# Altium schematic sheet STM32.SchDoc
size A3; Organization: RIT/SPEX; Address1: Rochester Institute of Technology; Address2: Rochester; Address3: New York; Address4: USA
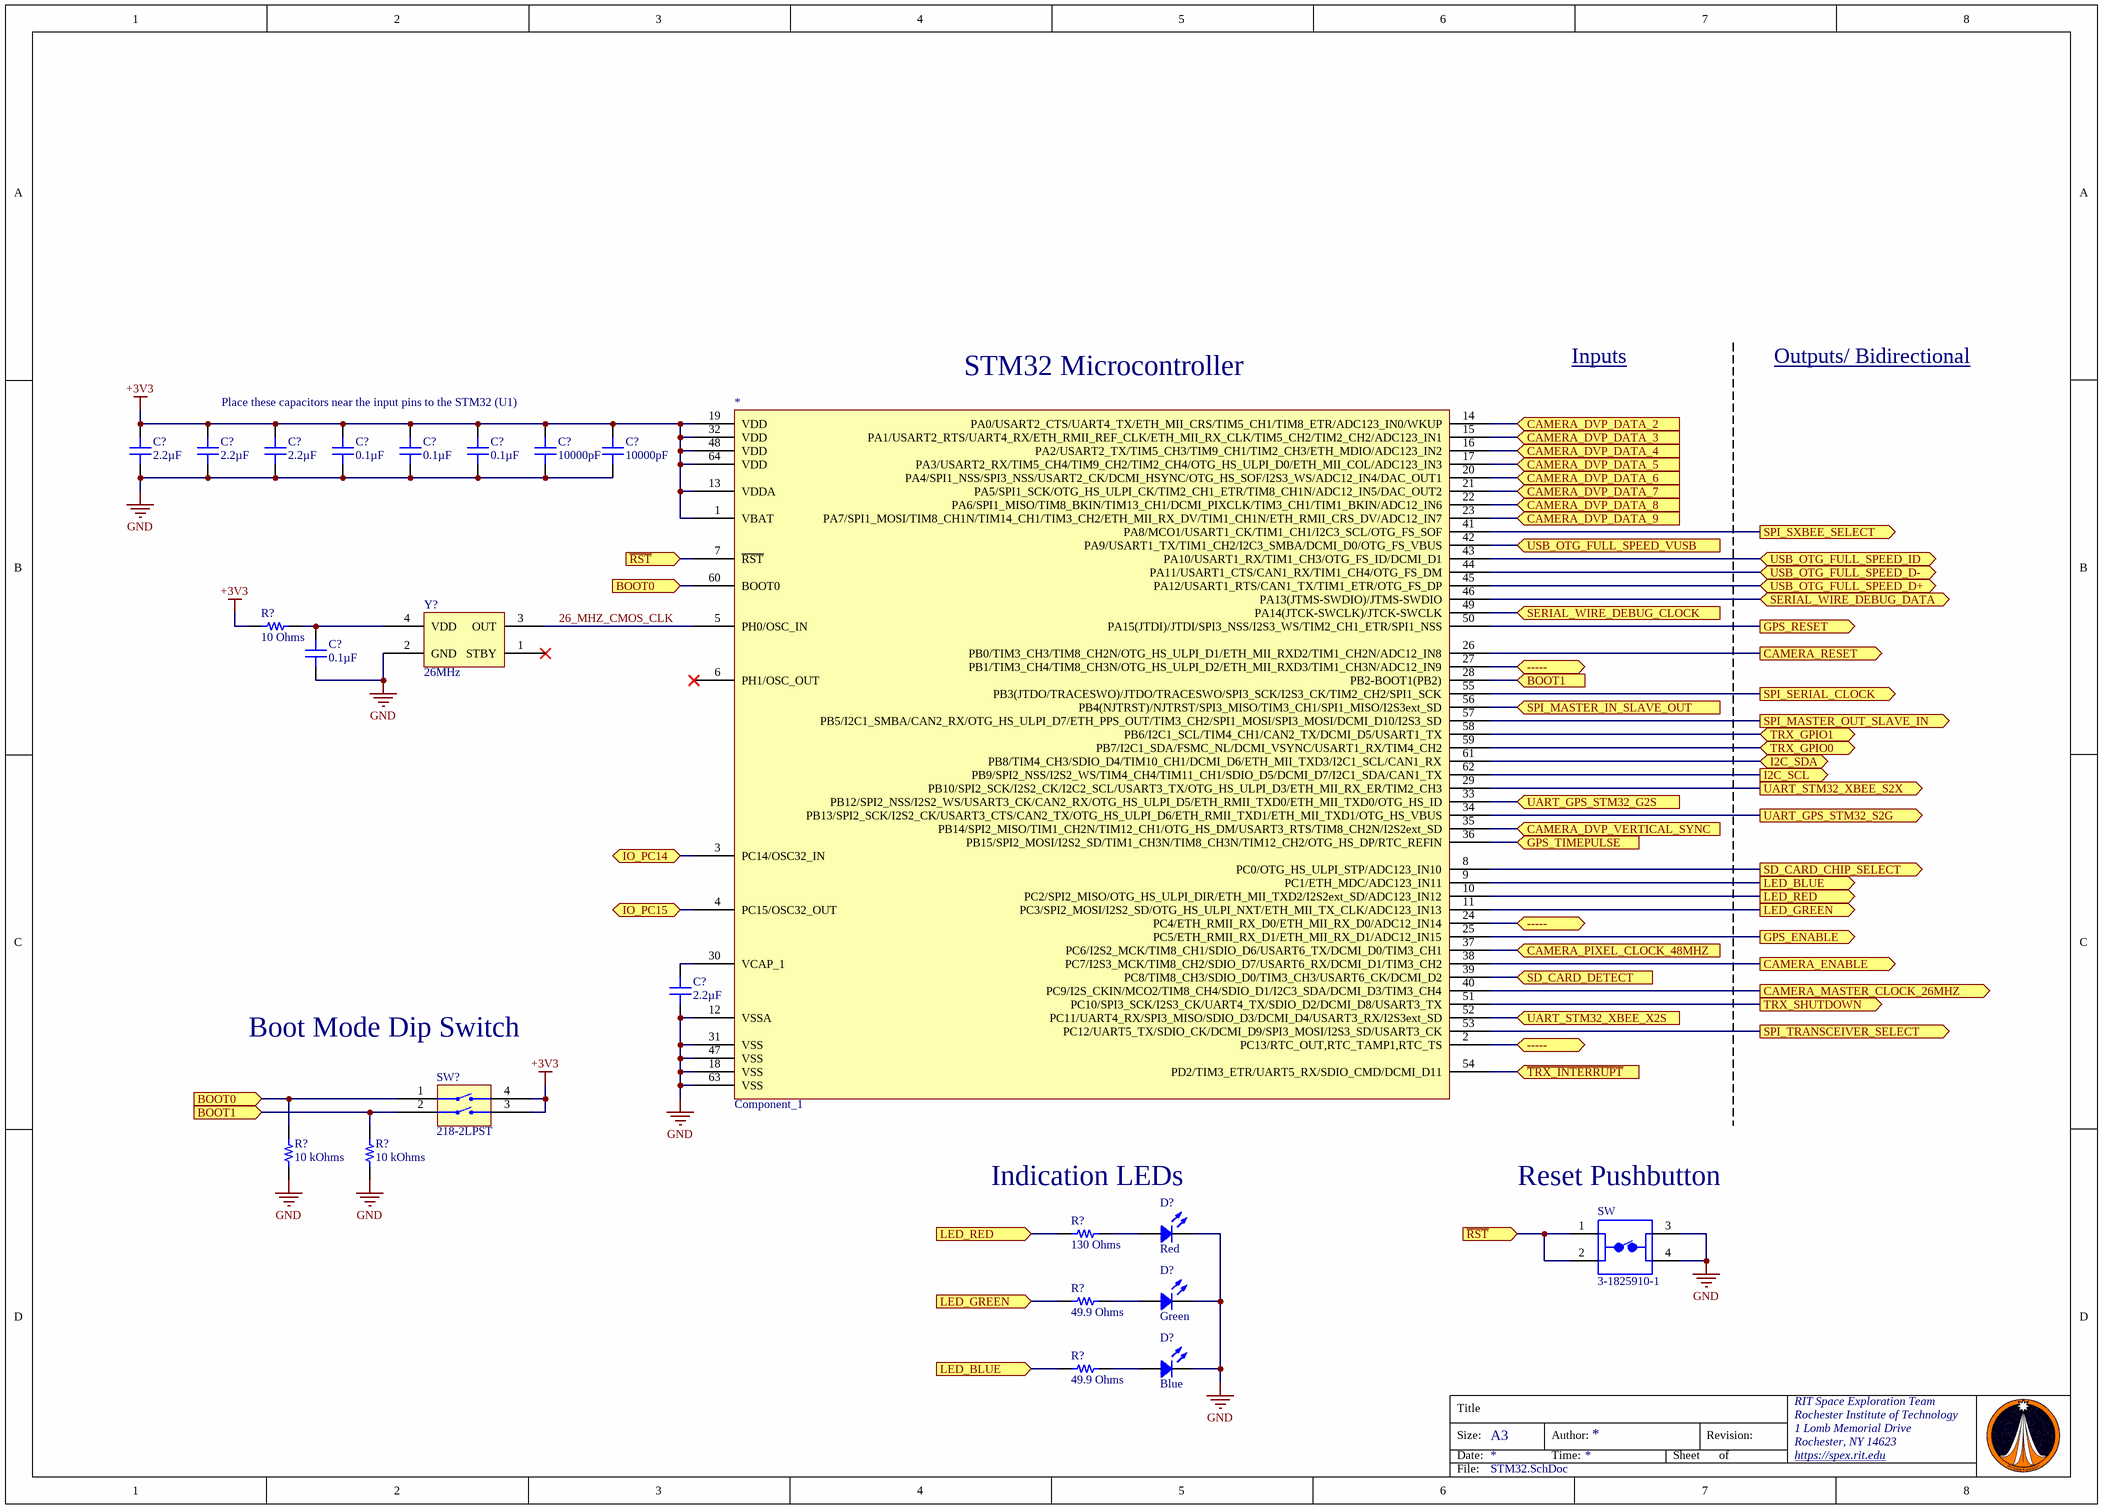
[diagram p0: STM32.SchDoc]

## Parts
(Parts that share a designator on the sheet are numbered #1, #2 ... from top to bottom, then left to right.)
*  Component_1
C?#1  2.2µF  [CAP 0603_1608]
C?#2  2.2µF  [CAP 0603_1608]
C?#3  2.2µF  [CAP 0603_1608]
C?#4  0.1µF  [CAP 0603_1608]
C?#5  0.1µF  [CAP 0603_1608]
C?#6  0.1µF  [CAP 0603_1608]
C?#7  10000pF  [CAP 0603_1608]
C?#8  10000pF  [CAP 0603_1608]
C?#9  0.1µF  [CAP 0603_1608]
C?#10  2.2µF  [CAP 0603_1608]
D?#1  Red  [LED 0603_1608 RED]
D?#2  Green  [LED 0603_1608 GREEN]
D?#3  Blue  [LED 0603_1608 BLUE]
R?#1  10 Ohms  [RES 0603_1608]
R?#2  10 kOhms  [RES 0603_1608]
R?#3  10 kOhms  [RES 0603_1608]
R?#4  130 Ohms  [RES 0603_1608]
R?#5  49.9 Ohms  [RES 0603_1608]
R?#6  49.9 Ohms  [RES 0603_1608]
SW  3-1825910-1  [TE_3-1825910-1]
SW?  218-2LPST  [CTS 218-2LPJ]
Y?  26MHz  [ABRACON ASDMB]

## Ports
----- (bidir), BOOT0 (in), BOOT1 (in), CAMERA_DVP_DATA_2 (in), CAMERA_DVP_DATA_3 (in), CAMERA_DVP_DATA_4 (in), CAMERA_DVP_DATA_5 (in), CAMERA_DVP_DATA_6 (in), CAMERA_DVP_DATA_7 (in), CAMERA_DVP_DATA_8 (in), CAMERA_DVP_DATA_9 (in), CAMERA_DVP_VERTICAL_SYNC (in), CAMERA_ENABLE (out), CAMERA_MASTER_CLOCK_26MHZ (out), CAMERA_PIXEL_CLOCK_48MHZ (in), CAMERA_RESET (out), GPS_ENABLE (out), GPS_RESET (out), GPS_TIMEPULSE (in), I2C_SCL (out), I2C_SDA (bidir), IO_PC14 (bidir), IO_PC15 (bidir), LED_BLUE (in), LED_BLUE (out), LED_GREEN (in), LED_GREEN (out), LED_RED (in), LED_RED (out), SD_CARD_CHIP_SELECT (out), SD_CARD_DETECT (in), SERIAL_WIRE_DEBUG_CLOCK (in), SERIAL_WIRE_DEBUG_DATA (bidir), SPI_MASTER_IN_SLAVE_OUT (in), SPI_MASTER_OUT_SLAVE_IN (out), SPI_SERIAL_CLOCK (out), SPI_SXBEE_SELECT (out), SPI_TRANSCEIVER_SELECT (out), TRX_GPIO0 (bidir), TRX_GPIO1 (bidir), TRX_SHUTDOWN (out), UART_GPS_STM32_G2S (in), UART_GPS_STM32_S2G (out), UART_STM32_XBEE_S2X (out), UART_STM32_XBEE_X2S (in), USB_OTG_FULL_SPEED_D+ (bidir), USB_OTG_FULL_SPEED_D- (bidir), USB_OTG_FULL_SPEED_ID (bidir), USB_OTG_FULL_SPEED_VUSB (in), ~{RST} (in), ~{TRX_INTERRUPT} (in)

## Nets
+3V3: *.1(VBAT) *.13(VDDA) *.19(VDD) *.32(VDD) *.48(VDD) *.64(VDD) C?#1.1 C?#2.1 C?#3.1 C?#4.1 C?#5.1 C?#6.1 C?#7.2 C?#8.2 R?#1.2 SW?.3(GND) SW?.4(GND)
GND: *.12(VSSA) *.18(VSS) *.31(VSS) *.47(VSS) *.63(VSS) C?#1.2 C?#2.2 C?#3.2 C?#4.2 C?#5.2 C?#6.2 C?#7.1 C?#8.1 C?#9.2 C?#10.2 D?#1.2 D?#2.2 D?#3.2 R?#2.1 R?#3.1 SW.3 SW.4 Y?.2(GND)
26_MHZ_CMOS_CLK: *.5(PH0/OSC_IN) Y?.3(OUT)
-----: *.2(PC13/RTC_OUT,RTC_TAMP1,RTC_TS) *.24(PC4/ETH_RMII_RX_D0/ETH_MII_RX_D0/ADC12_IN14) *.27(PB1/TIM3_CH4/TIM8_CH3N/OTG_HS_ULPI_D2/ETH_MII_RXD3/TIM1_CH3N/ADC12_IN9) ; port -----
BOOT0: *.60(BOOT0) R?#2.2 SW?.1(GND) ; port BOOT0
BOOT1: *.28(PB2-BOOT1(PB2)) R?#3.2 SW?.2(GND) ; port BOOT1
CAMERA_DVP_DATA_2: *.14(PA0/USART2_CTS/UART4_TX/ETH_MII_CRS/TIM5_CH1/TIM8_ETR/ADC123_IN0/WKUP) ; port CAMERA_DVP_DATA_2
CAMERA_DVP_DATA_3: *.15(PA1/USART2_RTS/UART4_RX/ETH_RMII_REF_CLK/ETH_MII_RX_CLK/TIM5_CH2/TIM2_CH2/ADC123_IN1) ; port CAMERA_DVP_DATA_3
CAMERA_DVP_DATA_4: *.16(PA2/USART2_TX/TIM5_CH3/TIM9_CH1/TIM2_CH3/ETH_MDIO/ADC123_IN2) ; port CAMERA_DVP_DATA_4
CAMERA_DVP_DATA_5: *.17(PA3/USART2_RX/TIM5_CH4/TIM9_CH2/TIM2_CH4/OTG_HS_ULPI_D0/ETH_MII_COL/ADC123_IN3) ; port CAMERA_DVP_DATA_5
CAMERA_DVP_DATA_6: *.20(PA4/SPI1_NSS/SPI3_NSS/USART2_CK/DCMI_HSYNC/OTG_HS_SOF/I2S3_WS/ADC12_IN4/DAC_OUT1) ; port CAMERA_DVP_DATA_6
CAMERA_DVP_DATA_7: *.21(PA5/SPI1_SCK/OTG_HS_ULPI_CK/TIM2_CH1_ETR/TIM8_CH1N/ADC12_IN5/DAC_OUT2) ; port CAMERA_DVP_DATA_7
CAMERA_DVP_DATA_8: *.22(PA6/SPI1_MISO/TIM8_BKIN/TIM13_CH1/DCMI_PIXCLK/TIM3_CH1/TIM1_BKIN/ADC12_IN6) ; port CAMERA_DVP_DATA_8
CAMERA_DVP_DATA_9: *.23(PA7/SPI1_MOSI/TIM8_CH1N/TIM14_CH1/TIM3_CH2/ETH_MII_RX_DV/TIM1_CH1N/ETH_RMII_CRS_DV/ADC12_IN7) ; port CAMERA_DVP_DATA_9
CAMERA_DVP_VERTICAL_SYNC: *.35(PB14/SPI2_MISO/TIM1_CH2N/TIM12_CH1/OTG_HS_DM/USART3_RTS/TIM8_CH2N/I2S2ext_SD) ; port CAMERA_DVP_VERTICAL_SYNC
CAMERA_ENABLE: *.38(PC7/I2S3_MCK/TIM8_CH2/SDIO_D7/USART6_RX/DCMI_D1/TIM3_CH2) ; port CAMERA_ENABLE
CAMERA_MASTER_CLOCK_26MHZ: *.40(PC9/I2S_CKIN/MCO2/TIM8_CH4/SDIO_D1/I2C3_SDA/DCMI_D3/TIM3_CH4) ; port CAMERA_MASTER_CLOCK_26MHZ
CAMERA_PIXEL_CLOCK_48MHZ: *.37(PC6/I2S2_MCK/TIM8_CH1/SDIO_D6/USART6_TX/DCMI_D0/TIM3_CH1) ; port CAMERA_PIXEL_CLOCK_48MHZ
CAMERA_RESET: *.26(PB0/TIM3_CH3/TIM8_CH2N/OTG_HS_ULPI_D1/ETH_MII_RXD2/TIM1_CH2N/ADC12_IN8) ; port CAMERA_RESET
GPS_ENABLE: *.25(PC5/ETH_RMII_RX_D1/ETH_MII_RX_D1/ADC12_IN15) ; port GPS_ENABLE
GPS_RESET: *.50(PA15(JTDI)/JTDI/SPI3_NSS/I2S3_WS/TIM2_CH1_ETR/SPI1_NSS) ; port GPS_RESET
GPS_TIMEPULSE: *.36(PB15/SPI2_MOSI/I2S2_SD/TIM1_CH3N/TIM8_CH3N/TIM12_CH2/OTG_HS_DP/RTC_REFIN) ; port GPS_TIMEPULSE
I2C_SCL: *.62(PB9/SPI2_NSS/I2S2_WS/TIM4_CH4/TIM11_CH1/SDIO_D5/DCMI_D7/I2C1_SDA/CAN1_TX) ; port I2C_SCL
I2C_SDA: *.61(PB8/TIM4_CH3/SDIO_D4/TIM10_CH1/DCMI_D6/ETH_MII_TXD3/I2C1_SCL/CAN1_RX) ; port I2C_SDA
IO_PC14: *.3(PC14/OSC32_IN) ; port IO_PC14
IO_PC15: *.4(PC15/OSC32_OUT) ; port IO_PC15
LED_BLUE: *.9(PC1/ETH_MDC/ADC123_IN11) R?#6.1 ; port LED_BLUE
LED_GREEN: *.11(PC3/SPI2_MOSI/I2S2_SD/OTG_HS_ULPI_NXT/ETH_MII_TX_CLK/ADC123_IN13) R?#5.1 ; port LED_GREEN
LED_RED: *.10(PC2/SPI2_MISO/OTG_HS_ULPI_DIR/ETH_MII_TXD2/I2S2ext_SD/ADC123_IN12) R?#4.1 ; port LED_RED
~{RST}: *.7(~{RST}) SW.1 SW.2 ; port ~{RST}
SD_CARD_CHIP_SELECT: *.8(PC0/OTG_HS_ULPI_STP/ADC123_IN10) ; port SD_CARD_CHIP_SELECT
SD_CARD_DETECT: *.39(PC8/TIM8_CH3/SDIO_D0/TIM3_CH3/USART6_CK/DCMI_D2) ; port SD_CARD_DETECT
SERIAL_WIRE_DEBUG_CLOCK: *.49(PA14(JTCK-SWCLK)/JTCK-SWCLK) ; port SERIAL_WIRE_DEBUG_CLOCK
SERIAL_WIRE_DEBUG_DATA: *.46(PA13(JTMS-SWDIO)/JTMS-SWDIO) ; port SERIAL_WIRE_DEBUG_DATA
SPI_MASTER_IN_SLAVE_OUT: *.56(PB4(NJTRST)/NJTRST/SPI3_MISO/TIM3_CH1/SPI1_MISO/I2S3ext_SD) ; port SPI_MASTER_IN_SLAVE_OUT
SPI_MASTER_OUT_SLAVE_IN: *.57(PB5/I2C1_SMBA/CAN2_RX/OTG_HS_ULPI_D7/ETH_PPS_OUT/TIM3_CH2/SPI1_MOSI/SPI3_MOSI/DCMI_D10/I2S3_SD) ; port SPI_MASTER_OUT_SLAVE_IN
SPI_SERIAL_CLOCK: *.55(PB3(JTDO/TRACESWO)/JTDO/TRACESWO/SPI3_SCK/I2S3_CK/TIM2_CH2/SPI1_SCK) ; port SPI_SERIAL_CLOCK
SPI_SXBEE_SELECT: *.41(PA8/MCO1/USART1_CK/TIM1_CH1/I2C3_SCL/OTG_FS_SOF) ; port SPI_SXBEE_SELECT
SPI_TRANSCEIVER_SELECT: *.53(PC12/UART5_TX/SDIO_CK/DCMI_D9/SPI3_MOSI/I2S3_SD/USART3_CK) ; port SPI_TRANSCEIVER_SELECT
~{TRX_INTERRUPT}: *.54(PD2/TIM3_ETR/UART5_RX/SDIO_CMD/DCMI_D11) ; port ~{TRX_INTERRUPT}
TRX_GPIO0: *.59(PB7/I2C1_SDA/FSMC_NL/DCMI_VSYNC/USART1_RX/TIM4_CH2) ; port TRX_GPIO0
TRX_GPIO1: *.58(PB6/I2C1_SCL/TIM4_CH1/CAN2_TX/DCMI_D5/USART1_TX) ; port TRX_GPIO1
TRX_SHUTDOWN: *.51(PC10/SPI3_SCK/I2S3_CK/UART4_TX/SDIO_D2/DCMI_D8/USART3_TX) ; port TRX_SHUTDOWN
UART_GPS_STM32_G2S: *.33(PB12/SPI2_NSS/I2S2_WS/USART3_CK/CAN2_RX/OTG_HS_ULPI_D5/ETH_RMII_TXD0/ETH_MII_TXD0/OTG_HS_ID) ; port UART_GPS_STM32_G2S
UART_GPS_STM32_S2G: *.34(PB13/SPI2_SCK/I2S2_CK/USART3_CTS/CAN2_TX/OTG_HS_ULPI_D6/ETH_RMII_TXD1/ETH_MII_TXD1/OTG_HS_VBUS) ; port UART_GPS_STM32_S2G
UART_STM32_XBEE_S2X: *.29(PB10/SPI2_SCK/I2S2_CK/I2C2_SCL/USART3_TX/OTG_HS_ULPI_D3/ETH_MII_RX_ER/TIM2_CH3) ; port UART_STM32_XBEE_S2X
UART_STM32_XBEE_X2S: *.52(PC11/UART4_RX/SPI3_MISO/SDIO_D3/DCMI_D4/USART3_RX/I2S3ext_SD) ; port UART_STM32_XBEE_X2S
USB_OTG_FULL_SPEED_D+: *.45(PA12/USART1_RTS/CAN1_TX/TIM1_ETR/OTG_FS_DP) ; port USB_OTG_FULL_SPEED_D+
USB_OTG_FULL_SPEED_D-: *.44(PA11/USART1_CTS/CAN1_RX/TIM1_CH4/OTG_FS_DM) ; port USB_OTG_FULL_SPEED_D-
USB_OTG_FULL_SPEED_ID: *.43(PA10/USART1_RX/TIM1_CH3/OTG_FS_ID/DCMI_D1) ; port USB_OTG_FULL_SPEED_ID
USB_OTG_FULL_SPEED_VUSB: *.42(PA9/USART1_TX/TIM1_CH2/I2C3_SMBA/DCMI_D0/OTG_FS_VBUS) ; port USB_OTG_FULL_SPEED_VUSB
Net*_30: *.30(VCAP_1) C?#10.1
NetC?#9_1: C?#9.1 R?#1.1 Y?.4(VDD)
NetD?#1_1: D?#1.1 R?#4.2
NetD?#2_1: D?#2.1 R?#5.2
NetD?#3_1: D?#3.1 R?#6.2

Not connected (* = marked no-connect by the designer): * 6(PH1/OSC_OUT)*; Y? 1(STBY)*

## Notes on the sheet
- (near *) STM32 Microcontroller
- Inputs
- Outputs/ Bidirectional
- (near C?#4) Place these capacitors near the input pins to the STM32 (U1)
- Boot Mode Dip Switch
- Indication LEDs
- (near SW) Reset Pushbutton
- Title
- Size:
- Date:
- A3
- Author:
- Time:
- Sheet
- Revision:
- of
- RIT Space Exploration Team
- Rochester Institute of Technology
- 1 Lomb Memorial Drive
- Rochester, NY 14623
- https://spex.rit.edu
- File:

## Library data of the parts
C?#1-C?#3 C?#10 = GRM188R71A225KE15D: CAP CER 2.2UF 10V X7R 0603; Manufacturer: Murata Electronics; Tolerance: ±10%; Part Number: GRM188R71A225KE15D; Value: 2.2µF; Applications: General Purpose; Capacitance: 2.2µF; ComponentLink1Description: Datasheet; ComponentLink1URL: https://www.murata.com/~/media/webrenewal/support/library/catalog/products/capacitor/mlcc/c02e.ashx?la=en-us; ComponentLink2Description: DigiKey Link; ComponentLink2URL: http://digikey.com/product-detail/en/murata-electronics/GRM188R71A225KE15D/490-4520-1-ND/1033279; Device Package: 0603 (1608 Metric); LastUpdated: 1/21/2020 12:02:07 AM; Lifecycle Status: Active; Minimum Order: 1; Mounting Type: Surface Mount, MLCC; Operating Temperature: -55°C ~ 125°C; Package / Case: 0603 (1608 Metric); Packaging: TapeAndReel; PartId: 3946; Part Status: Active; Price: 0.05; Series: GRM; Size / Dimension: 0.063" L x 0.031" W (1.60mm x 0.80mm); Supplier 1: DigiKey; Supplier Part Number 1: 490-4520-1-ND; Temperature Coefficient: X7R; Thickness (Max): 0.035" (0.90mm); Voltage - Rated: 10V
C?#4-C?#6 C?#9 = 100X14W104MV4T: CAP CER 0.1UF 10V X7R 0603; Manufacturer: Johanson Dielectrics Inc.; Tolerance: ±20%; Part Number: 100X14W104MV4T; Value: 0.1µF; Applications: Bypass, Decoupling; Capacitance: 0.1µF; ComponentLink1Description: Datasheet; ComponentLink1URL: https://www.johansondielectrics.com/downloads/x2y-filter-and-decoupling-capacitors.pdf; ComponentLink2Description: DigiKey Link; ComponentLink2URL: http://digikey.com/product-detail/en/johanson-dielectrics-inc/100X14W104MV4T/709-1101-1-ND/1655915; Device Package: 0603 (1608 Metric); Features: Low ESL (X2Y); LastUpdated: 1/21/2020 12:02:09 AM; Lifecycle Status: Active; Minimum Order: 1; Mounting Type: Surface Mount, MLCC; Operating Temperature: -55°C ~ 125°C; Package / Case: 0603 (1608 Metric); Packaging: TapeAndReel; PartId: 2680; Part Status: Active; Price: 0.11; Series: X2Y®; Size / Dimension: 0.064" L x 0.035" W (1.63mm x 0.89mm); Supplier 1: DigiKey; Supplier Part Number 1: 709-1101-1-ND; Temperature Coefficient: X7R; Thickness (Max): 0.026" (0.66mm); Voltage - Rated: 10V
C?#7 C?#8 = C0603S103K4RACTU: CAP CER 10000PF 16V X7R 0603; Manufacturer: KEMET; Tolerance: ±10%; Part Number: C0603S103K4RACTU; Value: 10000pF; Applications: Boardflex Sensitive; Capacitance: 10000pF; ComponentLink1Description: Datasheet; ComponentLink1URL: https://api.kemet.com/component-edge/download/datasheet/C0603S103K4RACTU.pdf; ComponentLink2Description: DigiKey Link; ComponentLink2URL: http://digikey.com/product-detail/en/kemet/C0603S103K4RACTU/399-9135-1-ND/3522653; Device Package: 0603 (1608 Metric); Features: Floating Electrode; LastUpdated: 1/21/2020 12:02:08 AM; Lifecycle Status: Active; Minimum Order: 1; Mounting Type: Surface Mount, MLCC; Operating Temperature: -55°C ~ 125°C; Package / Case: 0603 (1608 Metric); Packaging: TapeAndReel; PartId: 3312; Part Status: Active; Price: 0.07; Series: SMD Comm X7R FE; Size / Dimension: 0.063" L x 0.031" W (1.60mm x 0.80mm); Supplier 1: DigiKey; Supplier Part Number 1: 399-9135-1-ND; Temperature Coefficient: X7R; Thickness (Max): 0.034" (0.87mm); Voltage - Rated: 16V
D?#1 = LS Q976-NR-1: LED RED DIFFUSED 0603 SMD; Manufacturer: OSRAM Opto Semiconductors Inc.; Configuration: Standard; Current - Test: 20mA; Lens Color: White; Lens Size: 1.00mm x 0.80mm; Lens Style: Rectangle with Flat Top; Millicandela Rating: 104mcd; Viewing Angle: 160°; Voltage - Forward (Vf) (Typ): 2V; Wavelength - Dominant: 633nm; Wavelength - Peak: 645nm; Part Number: LS Q976-NR-1; Color: Red; ComponentLink1Description: Datasheet; ComponentLink1URL: https://dammedia.osram.info/media/resource/hires/osram-dam-2493499/LS%20Q976.pdf; ComponentLink2Description: DigiKey Link; ComponentLink2URL: http://digikey.com/product-detail/en/osram-opto-semiconductors-inc/LS-Q976-NR-1/475-2512-1-ND/1802639; Device Package: 0603 (1608 Metric); Height (Max): 0.80mm; LastUpdated: 1/21/2020 3:13:21 AM; Lens Transparency: Diffused; Lifecycle Status: Active; Minimum Order: 1; Mounting Type: Surface Mount; Package / Case: 0603 (1608 Metric); Packaging: TapeAndReel; PartId: 457; Part Status: Active; Price: 0.05; Series: CHIPLED 0603; Size / Dimension: 1.60mm L x 0.80mm W; Supplier 1: DigiKey; Supplier Part Number 1: 475-2512-1-ND; Supplier Device Package: 0603; Value: Red
D?#2 = LT Q39G-Q1OO-25-1: LED GREEN DIFFUSED 0603 SMD; Manufacturer: OSRAM Opto Semiconductors Inc.; Configuration: Standard; Current - Test: 5mA; Lens Color: White; Lens Size: 1.10mm x 0.80mm; Lens Style: Rectangle with Flat Top; Millicandela Rating: 175.5mcd; Viewing Angle: 170°, 130°; Voltage - Forward (Vf) (Typ): 2.85V; Wavelength - Dominant: 530nm; Wavelength - Peak: 525nm; Part Number: LT Q39G-Q1OO-25-1; Color: Green; ComponentLink1Description: Datasheet; ComponentLink1URL: https://dammedia.osram.info/media/resource/hires/osram-dam-2493418/LT%20Q39G.pdf; ComponentLink2Description: DigiKey Link; ComponentLink2URL: http://digikey.com/product-detail/en/osram-opto-semiconductors-inc/LT-Q39G-Q1OO-25-1/475-3442-1-ND/7908059; Device Package: 0603 (1608 Metric); Height (Max): 0.40mm; LastUpdated: 1/21/2020 3:12:08 AM; Lens Transparency: Diffused; Lifecycle Status: Active; Minimum Order: 1; Mounting Type: Surface Mount; Package / Case: 0603 (1608 Metric); Packaging: TapeAndReel; PartId: 689; Part Status: Active; Price: 0.08; Series: CHIPLED 0603; Size / Dimension: 1.60mm L x 0.80mm W; Supplier 1: DigiKey; Supplier Part Number 1: 475-3442-1-ND; Supplier Device Package: 0603; Value: Green
D?#3 = LB Q39E-N1OO-35-1: LED BLUE DIFFUSED 0603 SMD; Manufacturer: OSRAM Opto Semiconductors Inc.; Configuration: Standard; Current - Test: 5mA; Lens Color: White; Lens Size: 1.10mm x 0.80mm; Lens Style: Rectangle with Flat Top; Millicandela Rating: 42mcd; Viewing Angle: 170°, 130°; Voltage - Forward (Vf) (Typ): 2.85V; Wavelength - Dominant: 470nm; Wavelength - Peak: 465nm; Part Number: LB Q39E-N1OO-35-1; Color: Blue; ComponentLink1Description: Datasheet; ComponentLink1URL: https://dammedia.osram.info/media/resource/hires/osram-dam-2494408/LB%20Q39E.pdf; ComponentLink2Description: DigiKey Link; ComponentLink2URL: http://digikey.com/product-detail/en/osram-opto-semiconductors-inc/LB-Q39E-N1OO-35-1/475-2815-1-ND/2176354; Device Package: 0603 (1608 Metric); Height (Max): 0.40mm; LastUpdated: 1/21/2020 3:10:55 AM; Lens Transparency: Diffused; Lifecycle Status: Active; Minimum Order: 1; Mounting Type: Surface Mount; Package / Case: 0603 (1608 Metric); Packaging: TapeAndReel; PartId: 840; Part Status: Active; Price: 0.10; Series: CHIPLED 0603; Size / Dimension: 1.60mm L x 0.80mm W; Supplier 1: DigiKey; Supplier Part Number 1: 475-2815-1-ND; Supplier Device Package: 0603; Value: Blue
R?#1 = SG731JTTD100K: SMD RESISTOR; Manufacturer: KOA Speer Electronics, Inc.; Power (Watts): 0.1W, 1/10W; Temperature Coefficient: ±200ppm/°C; Tolerance: ±10%; Part Number: SG731JTTD100K; Value: 10 Ohms; ComponentLink1Description: Datasheet; ComponentLink1URL: http://www.koaspeer.com/catimages/Products/SG73/SG73.pdf; ComponentLink2Description: DigiKey Link; ComponentLink2URL: http://digikey.com/product-detail/en/koa-speer-electronics-inc/SG731JTTD100K/2019-SG731JTTD100KCT-ND/10187255; Composition: Thick Film; Device Package: 0603 (1608 Metric); Features: Automotive AEC-Q200, Moisture Resistant, Pulse Withstanding; Height - Seated (Max): 0.022" (0.55mm); LastUpdated: 1/21/2020 12:19:43 AM; Lifecycle Status: Active; Minimum Order: 1; Number of Terminations: 2; Operating Temperature: -55°C ~ 155°C; Package / Case: 0603 (1608 Metric); Packaging: TapeAndReel; PartId: 17783; Part Status: Active; Price: 0.02; Ratings: AEC-Q200; Resistance: 10 Ohms; Series: SG73; Size / Dimension: 0.063" L x 0.031" W (1.60mm x 0.80mm); Supplier 1: DigiKey; Supplier Part Number 1: 2019-SG731JTTD100KCT-ND; Supplier Device Package: 0603
R?#2 R?#3 = RT0603DRD0710KL: RES SMD 10K OHM 0.5% 1/10W 0603; Manufacturer: Yageo; Power (Watts): 0.1W, 1/10W; Temperature Coefficient: ±25ppm/°C; Part Number: RT0603DRD0710KL; Value: 10 kOhms; ComponentLink1Description: Datasheet; ComponentLink1URL: https://www.yageo.com/upload/media/product/productsearch/datasheet/rchip/PYu-RT_1-to-0.01_RoHS_L_11.pdf; ComponentLink2Description: DigiKey Link; ComponentLink2URL: http://digikey.com/product-detail/en/yageo/RT0603DRD0710KL/311-10KDCT-ND/1035680; Composition: Thin Film; Device Package: 0603 (1608 Metric); Height - Seated (Max): 0.022" (0.55mm); LastUpdated: 1/21/2020 12:24:44 AM; Lifecycle Status: Active; Minimum Order: 1; Number of Terminations: 2; Operating Temperature: -55°C ~ 155°C; Package / Case: 0603 (1608 Metric); Packaging: TapeAndReel; PartId: 5487; Part Status: Active; Price: 0.02; Resistance: 10 kOhms; Series: RT; Size / Dimension: 0.063" L x 0.031" W (1.60mm x 0.80mm); Supplier 1: DigiKey; Supplier Part Number 1: 311-10KDCT-ND; Supplier Device Package: 0603; Tolerance: ±0.5%
R?#4 = RT0603BRD07130RL: RES SMD 130 OHM 0.1% 1/10W 0603; Manufacturer: Yageo; Power (Watts): 0.1W, 1/10W; Temperature Coefficient: ±25ppm/°C; Part Number: RT0603BRD07130RL; Value: 130 Ohms; ComponentLink1Description: Datasheet; ComponentLink1URL: https://www.yageo.com/upload/media/product/productsearch/datasheet/rchip/PYu-RT_1-to-0.01_RoHS_L_11.pdf; ComponentLink2Description: DigiKey Link; ComponentLink2URL: http://digikey.com/product-detail/en/yageo/RT0603BRD07130RL/YAG1522CT-ND/5138970; Composition: Thin Film; Device Package: 0603 (1608 Metric); Height - Seated (Max): 0.022" (0.55mm); LastUpdated: 1/21/2020 12:22:42 AM; Lifecycle Status: Active; Minimum Order: 1; Number of Terminations: 2; Operating Temperature: -55°C ~ 155°C; Package / Case: 0603 (1608 Metric); Packaging: TapeAndReel; PartId: 10449; Part Status: Active; Price: 0.04; Resistance: 130 Ohms; Series: RT; Size / Dimension: 0.063" L x 0.031" W (1.60mm x 0.80mm); Supplier 1: DigiKey; Supplier Part Number 1: YAG1522CT-ND; Supplier Device Package: 0603; Tolerance: ±0.1%
R?#5 R?#6 = RT0603FRE0749R9L: RES SMD 49.9 OHM 1% 1/10W 0603; Manufacturer: Yageo; Power (Watts): 0.1W, 1/10W; Temperature Coefficient: ±50ppm/°C; Part Number: RT0603FRE0749R9L; Value: 49.9 Ohms; ComponentLink1Description: Datasheet; ComponentLink1URL: https://www.yageo.com/upload/media/product/productsearch/datasheet/rchip/PYu-RT_1-to-0.01_RoHS_L_11.pdf; ComponentLink2Description: DigiKey Link; ComponentLink2URL: http://digikey.com/product-detail/en/yageo/RT0603FRE0749R9L/YAG5744CT-ND/7648621; Composition: Thin Film; Device Package: 0603 (1608 Metric); Height - Seated (Max): 0.022" (0.55mm); LastUpdated: 1/21/2020 12:24:38 AM; Lifecycle Status: Active; Minimum Order: 1; Number of Terminations: 2; Operating Temperature: -55°C ~ 155°C; Package / Case: 0603 (1608 Metric); Packaging: TapeAndReel; PartId: 5683; Part Status: Active; Price: 0.01; Resistance: 49.9 Ohms; Series: RT; Size / Dimension: 0.063" L x 0.031" W (1.60mm x 0.80mm); Supplier 1: DigiKey; Supplier Part Number 1: YAG5744CT-ND; Supplier Device Package: 0603; Tolerance: ±1%
SW = 3-1825910-1: Switch Push Button OFF _ON_ SPST Round Button 0.05A 24VDC Momentary Contact PC Pins Thru-Hole; MF: TE Connectivity; Availability: Unavailable; SnapEDA_Link: https://www.snapeda.com/parts/3-1825910-1/TE%20Connectivity%20ALCOSWITCH%20Switches/view-part/452461/?ref=snap; Price: None; EU_RoHS_Compliance: Compliant; Package: None; TE_purchase_URL: https://www.te.com/usa-en/product-3-1825910-1.html?te_bu=Cor&te_type=disp&te_campaign=seda_glo_cor-seda-global-disp-prtnr-fy19-seda-model-bom-cta_sma-317_1&elqCampaignId=32493; MP: 3-1825910-1; Value: *
SW? = 218-2LPST: SWITCH SLIDE DIP SPST 25MA 24V; Manufacturer: CTS Electrocomponents; Actuator Level: Flush, Recessed; Actuator Type: Slide (Standard); Number of Positions: 2; Pitch: 0.050" (1.27mm), Half; Voltage Rating: 24VDC; Washable: Yes; Part Number: 218-2LPST; Circuit: SPST; ComponentLink1Description: Datasheet; ComponentLink1URL: https://www.ctscorp.com/wp-content/uploads/218.pdf; ComponentLink2Description: DigiKey Link; ComponentLink2URL: http://digikey.com/product-detail/en/cts-electrocomponents/218-2LPST/CT2182LPST-ND/267319; Contact Finish: Gold; Contact Material: Beryllium Copper; Current Rating (Amps): 25mA; Features: Epoxy Sealed Terminals, Tape Seal; Height Above Board: 0.104" (2.65mm); LastUpdated: 1/4/2020 6:30:26 PM; Lifecycle Status: Active; Minimum Order: 1; Mounting Type: Surface Mount; Operating Temperature: -55°C ~ 85°C; Packaging: Tube; PartId: 3; Part Status: Active; Price: 1.04; Series: 218; Supplier 1: DigiKey; Supplier Part Number 1: CT2182LPST-ND; Termination Style: Gull Wing
Y? = ASDMB-26.000MHZ-LY-T: MEMS OSC XO 26.0000MHZ LVCMOS; Manufacturer: Abracon LLC; Current - Supply (Max): 16mA; Frequency Stability: ±10ppm; Function: Standby (Power Down); Voltage - Supply: 1.8V ~ 3.3V; Part Number: ASDMB-26.000MHZ-LY-T; Base Resonator: MEMS; ComponentLink1Description: Datasheet; ComponentLink1URL: https://abracon.com/Oscillators/ASDMB.pdf; ComponentLink2Description: DigiKey Link; ComponentLink2URL: http://digikey.com/product-detail/en/abracon-llc/ASDMB-26.000MHZ-LY-T/535-11189-1-ND/2624286; Device Package: 4-SMD, No Lead; Frequency: 26MHz; Height - Seated (Max): 0.035" (0.90mm); LastUpdated: 1/21/2020 3:21:44 AM; Lifecycle Status: Active; Minimum Order: 1; Mounting Type: Surface Mount; Operating Temperature: -40°C ~ 85°C; Output: LVCMOS; Package / Case: 4-SMD, No Lead; Packaging: TapeAndReel; PartId: 68; Part Status: Active; Price: 1.12; Series: ASDMB, Pure Silicon™; Size / Dimension: 0.098" L x 0.079" W (2.50mm x 2.00mm); Supplier 1: DigiKey; Supplier Part Number 1: 535-11189-1-ND; Type: XO (Standard); Value: 26MHz